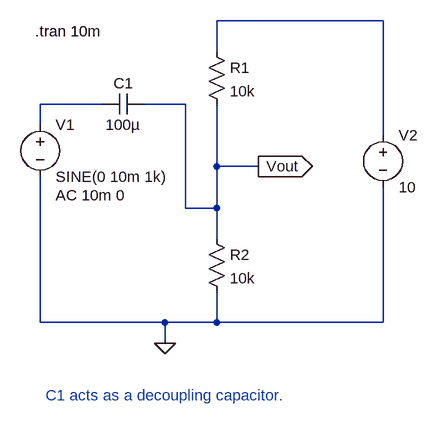
[diagram p0: schematic CL1_T5_SmallSignalLargeSignal.asc]
CL1_T5_SmallSignalLargeSignal.asc, the LTspice schematic file:
Version 4.1
SHEET 1 880 680
WIRE 640 -32 384 -32
WIRE 384 16 384 -32
WIRE 208 96 112 96
WIRE 336 96 272 96
WIRE 112 128 112 96
WIRE 640 144 640 -32
WIRE 384 192 384 96
WIRE 448 192 384 192
WIRE 336 256 336 96
WIRE 384 256 384 192
WIRE 384 256 336 256
WIRE 384 304 384 256
WIRE 112 432 112 208
WIRE 304 432 112 432
WIRE 384 432 384 384
WIRE 384 432 304 432
WIRE 640 432 640 224
WIRE 640 432 384 432
WIRE 304 464 304 432
FLAG 304 464 0
FLAG 448 192 Vout
IOPIN 448 192 Out
SYMBOL voltage 112 112 R0
WINDOW 123 24 124 Left 2
WINDOW 39 0 0 Left 0
SYMATTR InstName V1
SYMATTR Value SINE(0 10m 1k)
SYMATTR Value2 AC 10m 0
SYMBOL voltage 640 128 R0
WINDOW 123 0 0 Left 0
WINDOW 39 0 0 Left 0
SYMATTR InstName V2
SYMATTR Value 10
SYMBOL res 368 0 R0
SYMATTR InstName R1
SYMATTR Value 10k
SYMBOL res 368 288 R0
SYMATTR InstName R2
SYMATTR Value 10k
SYMBOL cap 272 80 R90
WINDOW 0 0 32 VBottom 2
WINDOW 3 32 32 VTop 2
SYMATTR InstName C1
SYMATTR Value 100µ
TEXT 104 -16 Left 2 !.tran 10m
TEXT 120 544 Left 2 ;C1 acts as a decoupling capacitor.

The netlist it stands for:
* CL1_T5_SmallSignalLargeSignal.asc
V1 N002 0 SINE(0 10m 1k) AC 10m 0
V2 N001 0 10
R1 N001 Vout 10k
R2 Vout 0 10k
C1 Vout N002 100µ
.tran 10m
* C1 acts as a decoupling capacitor.
.backanno
.end